# Altium project DARKYDEN.PrjPcb (part 4 of 9)
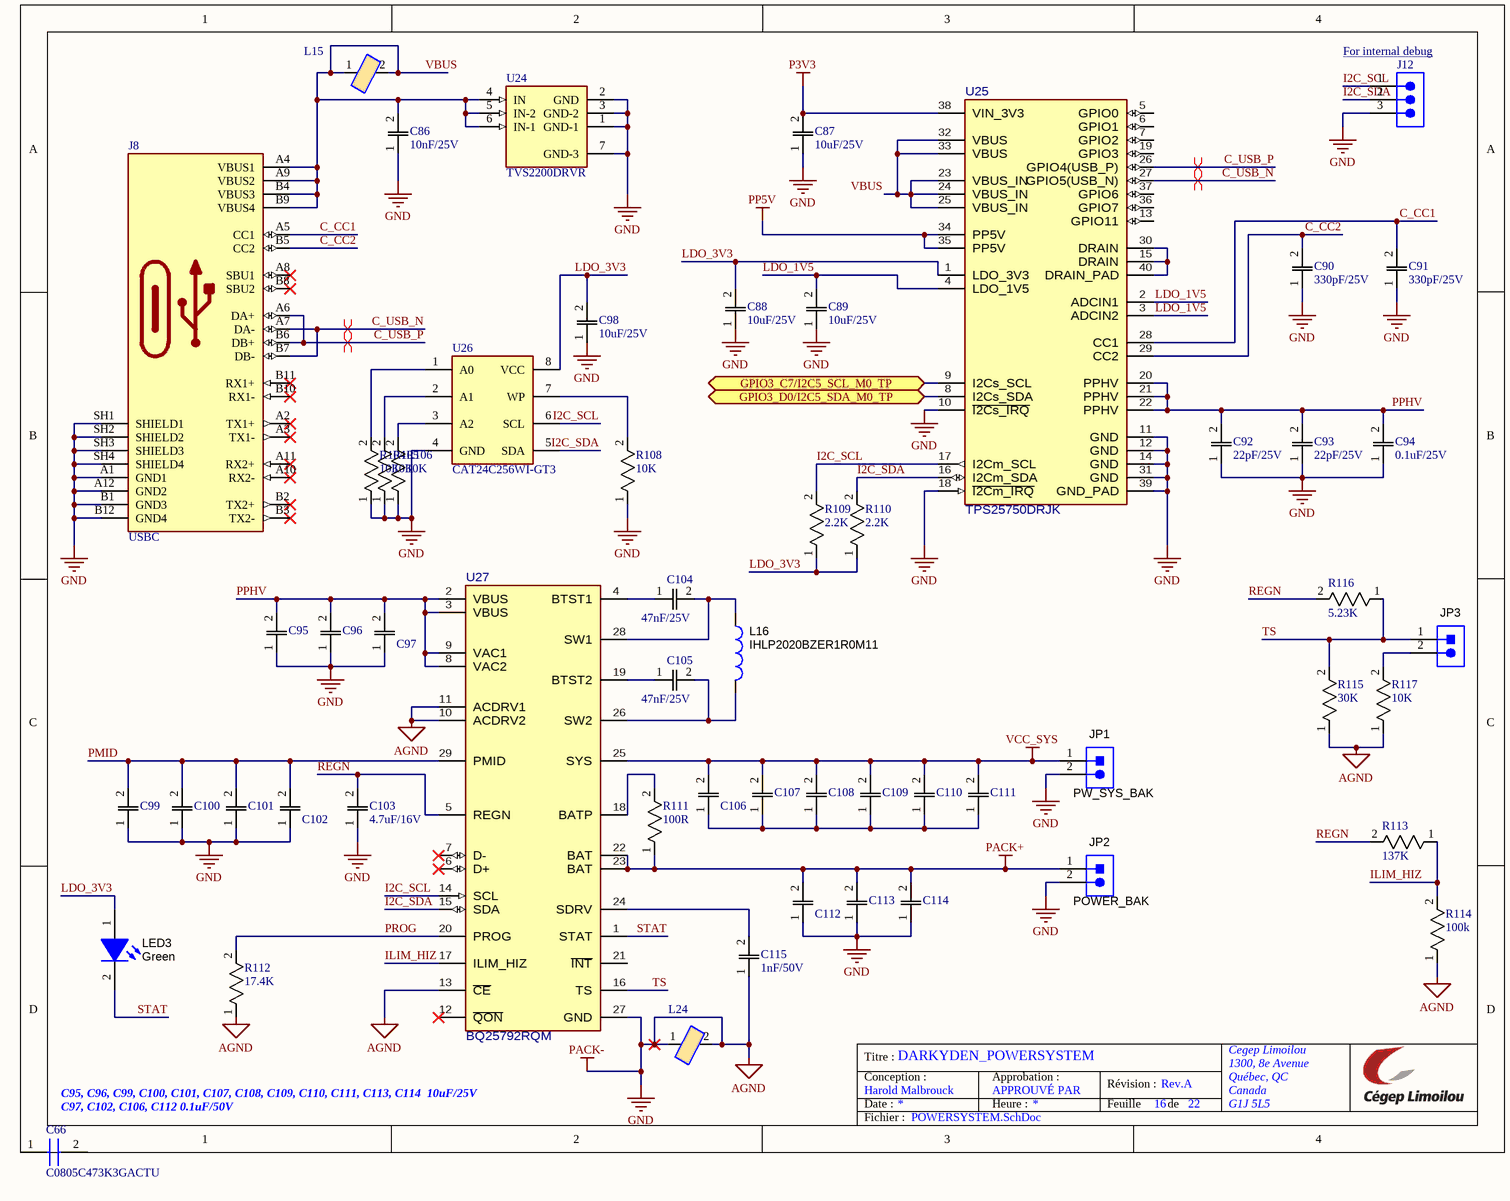
[diagram p10: POWERSYSTEM.SchDoc]

## Sheet POWERSYSTEM.SchDoc: DARKYDEN_POWERSYSTEM (continued)
### Library data of the parts
C66 = C0805C473K3GACTU: Capacitor; Manufacturer_Name: KEMET; Datasheet Link: https://content.kemet.com/datasheets/KEM_C1003_C0G_SMD.pdf; Height: 1.1mm; Manufacturer_Part_Number: C0805C473K3GACTU; Mouser Part Number: 80-C0805C473K3G; Mouser Price/Stock: https://www.mouser.co.uk/ProductDetail/KEMET/C0805C473K3GACTU?qs=hgatC5DSIDyRnutBseD8Ww%3D%3D; Arrow Part Number: C0805C473K3GACTU; Arrow Price/Stock: https://www.arrow.com/en/products/c0805c473k3gactu/kemet-corporation
C86 = C0805C103K3RACTU: 0.01uF 25V X7R 10% SMD 0805 125C Paper T/R; Manufacturer_Name: KEMET; Dielectric Material: Ceramic; Material: 4241ConductorMaterial; Value: 10nF; Dissipation Factor: 3.5%; Temperature Coefficient: 30ppm/°C; Datasheet Link: https://content.kemet.com/datasheets/KEM_C1002_X7R_SMD.pdf; Height: 1.1mm; Manufacturer_Part_Number: C0805C103K3RACTU; Mouser Part Number: 80-C0805C103K3R; Mouser Price/Stock: https://www.mouser.co.uk/ProductDetail/KEMET/C0805C103K3RACTU?qs=5x48ZXzl2vJVSrNkrDG8kg%3D%3D; Arrow Part Number: C0805C103K3RACTU; Arrow Price/Stock: https://www.arrow.com/en/products/c0805c103k3ractu/kemet-corporation; Supplier: Digikey; Supplier Part Number: 399-C0805C103K3RACTUCT-ND; Manufacturer: KEMET; Manufacturer Part Number: C0805C103K3RACTU; RoHS: Yes; Category: Ceramic Capacitors; Stock: 5327; Pricing: 1=0.12, 10=0.066, 100=0.0398, 1000=0.03092 (USD); Mounting Technology: Surface Mount; Case/Package: 0805; Case Code (Metric): 2012; Case Code (Imperial): 0805; Min Operating Temperature: -55°C; Max Operating Temperature: 125°C; Package Quantity: 4000; Voltage Rating: 25V; Tolerance: 10%; Packaging: Tape and Reel; Voltage Rating (DC): 25V; Dielectric: X7R; Termination: SMD/SMT; Series: SMD Comm X7R; Construction: Flat; Length: 2mm; Width: 1.2mm; Thickness: 0.035inch; Lead Pitch: 0.75mm; Depth: 1.25mm; Radiation Hardening: No; Reach SVHC Compliant: No; RoHS Compliant: Yes; ComponentLink1URL: http://www.farnell.com/datasheets/2746089.pdf?src-supplier=Farnell; ComponentLink1Description: http://www.farnell.com/datasheets/2746089.pdf?src-supplier=Farnell; ComponentLink2URL: http://www.farnell.com/datasheets/2315422.pdf?src-supplier=Farnell; ComponentLink2Description: http://www.farnell.com/datasheets/2315422.pdf?src-supplier=Farnell; ComponentLink3URL: http://components.arrow.com/part/dataview/2091057S98063N7429?src-supplier=Arrow+Electronics; ComponentLink3Description: http://components.arrow.com/part/dataview/2091057S98063N7429?src-supplier=Arrow+Electronics; ComponentLink4URL: http://www.mouser.com/ds/2/212/KEM_C1002_X7R_SMD-1102033.pdf?src-supplier=Mouser; ComponentLink4Description: http://www.mouser.com/ds/2/212/KEM_C1002_X7R_SMD-1102033.pdf?src-supplier=Mouser; ComponentLink5URL: https://www.verical.com/server-webapp/html/getDatasheet?partID=697850&src-supplier=Verical; ComponentLink5Description: https://www.verical.com/server-webapp/html/getDatasheet?partID=697850&src-supplier=Verical; ComponentLink6URL: http://www.jameco.com/Jameco/Products/ProdDS/1637716.pdf?src-supplier=Jameco; ComponentLink6Description: http://www.jameco.com/Jameco/Products/ProdDS/1637716.pdf?src-supplier=Jameco; ComponentLink7URL: https://api.kemet.com/component-edge/download/datasheet/C0805C103K3RACTU.pdf?src-supplier=Digikey; ComponentLink7Description: https://api.kemet.com/component-edge/download/datasheet/C0805C103K3RACTU.pdf?src-supplier=Digikey; ComponentLink8URL: http://capacitoredge.kemet.com/capedge2/DataSheet?pn=C0805C103K3RACTU&src-supplier=Avnet; ComponentLink8Description: http://capacitoredge.kemet.com/capedge2/DataSheet?pn=C0805C103K3RACTU&src-supplier=Avnet; ComponentLink9URL: http://www.farnell.com/datasheets/2746089.pdf?src-supplier=Newark; ComponentLink9Description: http://www.farnell.com/datasheets/2746089.pdf?src-supplier=Newark; ComponentLink10URL: https://datasheet.octopart.com/C0805C103K3RACTU-KEMET-datasheet-37550250.pdf?src-supplier=Electro+Sonic; ComponentLink10Description: https://datasheet.octopart.com/C0805C103K3RACTU-KEMET-datasheet-37550250.pdf?src-supplier=Electro+Sonic; ComponentLink11URL: https://datasheet.octopart.com/C0805C103K3RACTU-KEMET-datasheet-130259678.pdf?src-supplier=TME; ComponentLink11Description: https://datasheet.octopart.com/C0805C103K3RACTU-KEMET-datasheet-130259678.pdf?src-supplier=TME
C87-C89 C95 C96 C98-C101 C107-C111 C113 C114 = C0805C106K3PACTU: 10uF / 25 VDC, +85degC, X5R Dielec, +/-10% | KEMET C0805C106K3PACTU 0805; Dielectric Material: Ceramic; Material: 4241ConductorMaterial; Voltage Rating: 25V; Dissipation Factor: 10%; Mfr_Name: Kemet; Supplier: Digikey; Supplier Part Number: 399-11939-1-ND; Manufacturer: KEMET; Manufacturer Part Number: C0805C106K3PACTU; RoHS: Yes; Category: Ceramic Capacitors; Case/Package: 0805; Case Code (Metric): 2012; Case Code (Imperial): 0805; Min Operating Temperature: -55°C; Max Operating Temperature: 85°C; Dielectric: X5R; Packaging: Cut Tape; Voltage: 25V; Termination: Solder; Tolerance: 10%; Value: 10uF; Series: SMD Comm X5R; Voltage Rating (DC): 25V; Length: 2mm; Height: 1.25mm; Depth: 1.25mm; Reach SVHC Compliant: No; RoHS Compliant: Yes; Lead Free: 5697LeadFree; ComponentLink1URL: http://www.farnell.com/datasheets/2741185.pdf?src-supplier=Farnell; ComponentLink1Description: http://www.farnell.com/datasheets/2741185.pdf?src-supplier=Farnell; ComponentLink2URL: http://www.alliedelec.com/m/d/f3c02ddb98afa3dd1adcb801109671e9.pdf?src-supplier=Allied+Electronics; ComponentLink2Description: http://www.alliedelec.com/m/d/f3c02ddb98afa3dd1adcb801109671e9.pdf?src-supplier=Allied+Electronics; ComponentLink3URL: https://api.kemet.com/component-edge/download/datasheet/C0805C106K3PAC7800.pdf?src-supplier=Digikey; ComponentLink3Description: https://api.kemet.com/component-edge/download/datasheet/C0805C106K3PAC7800.pdf?src-supplier=Digikey; ComponentLink4URL: http://www.kemet.com/Lists/ProductCatalog/Attachments/19/KEM_C1006_X5R_SMD.pdf?src-supplier=Avnet; ComponentLink4Description: http://www.kemet.com/Lists/ProductCatalog/Attachments/19/KEM_C1006_X5R_SMD.pdf?src-supplier=Avnet; ComponentLink5URL: http://www.farnell.com/datasheets/2741185.pdf?src-supplier=Element14; ComponentLink5Description: http://www.farnell.com/datasheets/2741185.pdf?src-supplier=Element14; ComponentLink6URL: http://www.farnell.com/datasheets/2741185.pdf?src-supplier=Newark; ComponentLink6Description: http://www.farnell.com/datasheets/2741185.pdf?src-supplier=Newark; ComponentLink7URL: https://datasheet.octopart.com/C0805C106K3PACTU-Kemet-datasheet-46909776.pdf?src-supplier=Element14; ComponentLink7Description: https://datasheet.octopart.com/C0805C106K3PACTU-Kemet-datasheet-46909776.pdf?src-supplier=Element14
C90 C91 = C0805C331K3GACTU: 330pF 25VC0G 0805 10%; Manufacturer_Name: KEMET; Dielectric Material: Ceramic; Material: 4241ConductorMaterial; Voltage Rating (DC): 25V; Dielectric: C0G; Temperature Coefficient: 30ppm/°C; Datasheet Link: https://content.kemet.com/datasheets/KEM_C1003_C0G_SMD.pdf; Height: 1.1mm; Manufacturer_Part_Number: C0805C331K3GACTU; Mouser Part Number: 80-C0805C331K3G; Mouser Price/Stock: https://www.mouser.com/Search/Refine.aspx?Keyword=80-C0805C331K3G; Supplier: Digikey; Supplier Part Number: 399-C0805C331K3GACTUCT-ND; Manufacturer: KEMET; Manufacturer Part Number: C0805C331K3GACTU; RoHS: Yes; Category: Ceramic Capacitors; Stock: 3769; Pricing: 1=0.26, 10=0.151, 100=0.0965, 1000=0.06823 (USD); Mounting Technology: Surface Mount; Case/Package: 0805; Case Code (Imperial): 0805; Case Code (Metric): 2012; Weight: 0.000194oz; Min Operating Temperature: -55°C; Max Operating Temperature: 125°C; Value: 330pF; Tolerance: 10%; Construction: Flat; Voltage Rating: 25V; Packaging: Tape and Reel; Termination: SMD/SMT; Series: SMD Comm C0G; Length: 2mm; Width: 1.25mm; Depth: 1.25mm; Lead Free: Lead Free; RoHS Compliant: Yes; ComponentLink1URL: http://www.mouser.com/ds/2/212/KEM_C1003_C0G_SMD-1101588.pdf?src-supplier=Mouser; ComponentLink1Description: http://www.mouser.com/ds/2/212/KEM_C1003_C0G_SMD-1101588.pdf?src-supplier=Mouser; ComponentLink2URL: http://components.arrow.com/part/dataview/29547903S8614793N7429?src-supplier=Arrow+Electronics; ComponentLink2Description: http://components.arrow.com/part/dataview/29547903S8614793N7429?src-supplier=Arrow+Electronics; ComponentLink3URL: https://api.kemet.com/component-edge/download/datasheet/C0805C331K3GACTU.pdf?src-supplier=Digikey; ComponentLink3Description: https://api.kemet.com/component-edge/download/datasheet/C0805C331K3GACTU.pdf?src-supplier=Digikey
C92 C93 = CL21A226MAYNNNE: 22uF/25V 20% X5R 0805; Manufacturer_Name: SAMSUNG; Value: 22uF; Voltage Rating: 25V; Datasheet Link: http://product.samsungsem.com/mlcc/CL21A226MAYNNN.do; Height: 1.45mm; Manufacturer_Part_Number: CL21A226MAYNNNE; Mouser Part Number: 187-CL21A226MAYNNNE; Mouser Price/Stock: https://www.mouser.co.uk/ProductDetail/Samsung-Electro-Mechanics/CL21A226MAYNNNE?qs=xZ%2FP%252Ba9zWqY%2FVvCfXjMhqg%3D%3D; Arrow Part Number: CL21A226MAYNNNE; Arrow Price/Stock: https://www.arrow.com/en/products/cl21a226maynnne/samsung-electro-mechanics?utm_currency=USD&region=nac; Supplier: Digikey; Supplier Part Number: 1276-CL21A226MAYNNNECT-ND; Manufacturer: Samsung; Manufacturer Part Number: CL21A226MAYNNNE; RoHS: Yes; Category: Ceramic Capacitors; Stock: 687201; Pricing: 1=0.14, 10=0.083, 100=0.0544, 1000=0.04301 (USD); Case/Package: 0805; Min Operating Temperature: -55°C; Max Operating Temperature: 85°C; Dielectric: X5R; Tolerance: 20%; Voltage Rating (DC): 25V; RoHS Compliant: Yes; ComponentLink1URL: https://datasheet.octopart.com/CL21A226MAYNNNE-Samsung-Electro-Mechanics-datasheet-149154243.pdf?src-supplier=Future+Electronics; ComponentLink1Description: https://datasheet.octopart.com/CL21A226MAYNNNE-Samsung-Electro-Mechanics-datasheet-149154243.pdf?src-supplier=Future+Electronics
C94 = C0805C104K3RACTU: 0.1uF 25V X7R 10% SMD 0805 125C Plastic T/R; Mfr_Name: Kemet; Material: 4241ConductorMaterial; Value: 100nF; Temperature Coefficient: 30ppm/°C; Supplier: Digikey; Supplier Part Number: 399-C0805C104K3RACTUCT-ND; Manufacturer: KEMET; Manufacturer Part Number: C0805C104K3RACTU; RoHS: Yes; Category: Ceramic Capacitors; Mounting Technology: Surface Mount,PCB; Case/Package: 0805; Pins: 2NUMBER; Case Code (Imperial): 0805; Case Code (Metric): 2012; Min Operating Temperature: -55°C; Max Operating Temperature: 125°C; Packaging: Tape and Reel; Tolerance: 10%; Dielectric: X7R; Termination: SMD/SMT; Package Quantity: 4000; Voltage Rating: 25V; Series: SMD Comm X7R; Voltage Rating (DC): 25V; Construction: Flat; Length: 2mm; Width: 1.2mm; Height: 0.9mm; Depth: 1.25mm; Lead Pitch: 0.75mm; Thickness: 889um; Radiation Hardening: No; RoHS Compliant: Yes; Lead Free: 5697LeadFree; Reach SVHC Compliant: 4186SVHC; ComponentLink1URL: https://datasheet.ciiva.com/7842/kem-c1002-x7r-smd-7842536.pdf?src-supplier=Element14; ComponentLink1Description: https://datasheet.ciiva.com/7842/kem-c1002-x7r-smd-7842536.pdf?src-supplier=Element14; ComponentLink2URL: https://datasheet.ciiva.com/7842/kem-c1002-x7r-smd-7842538.pdf?src-supplier=Element14; ComponentLink2Description: https://datasheet.ciiva.com/7842/kem-c1002-x7r-smd-7842538.pdf?src-supplier=Element14
C97 C102 C106 C112 = C0805C104K5RACTU: 0.1uF/50V X7R 10% 0805 Multilayer Ceramic Capacitors Mlcc Smd/Smt Rohs; Manufacturer_Name: KEMET; Material: 4241ConductorMaterial; Value: 100nF; Voltage Rating: 50V; Voltage: 500V; Temperature Coefficient: 30ppm/°C; Datasheet Link: https://content.kemet.com/datasheets/KEM_C1002_X7R_SMD.pdf; Height: 1.1mm; Manufacturer_Part_Number: C0805C104K5RACTU; Mouser Part Number: 80-C0805C104K5R; Mouser Price/Stock: https://www.mouser.co.uk/ProductDetail/KEMET/C0805C104K5RACTU?qs=Pc30aiB8zWUISNb2Qeyxfw%3D%3D; Arrow Part Number: C0805C104K5RACTU; Arrow Price/Stock: https://www.arrow.com/en/products/c0805c104k5ractu/kemet-corporation?utm_currency=USD&region=nac; Supplier: Digikey; Supplier Part Number: 399-C0805C104K5RACTUCT-ND; Manufacturer: KEMET; Manufacturer Part Number: C0805C104K5RACTU; RoHS: Yes; Category: Ceramic Capacitors; Stock: 625118; Pricing: 1=0.09, 10=0.037, 100=0.0248, 1000=0.0224 (USD); Mounting Technology: Surface Mount,PCB; Case/Package: 0805; Pins: 2; Case Code (Imperial): 0805; Case Code (Metric): 2012; Min Operating Temperature: -55°C; Max Operating Temperature: 125°C; Package Quantity: 4000; Tolerance: 10%; Packaging: Tape and Reel; Voltage Rating (DC): 50V; Dielectric: X7R; Termination: SMD/SMT; Series: SMD Comm X7R; Construction: Flat; Length: 2mm; Width: 1.2mm; Lead Pitch: 0.75mm; Depth: 1.25mm; Radiation Hardening: No; Reach SVHC Compliant: No; RoHS Compliant: Yes; Lead Free: 5697LeadFree; ComponentLink1URL: https://datasheet.ciiva.com/32431/slceramic-chip-condensers-e-32431755.pdf?src-supplier=Distrelec; ComponentLink1Description: https://datasheet.ciiva.com/32431/slceramic-chip-condensers-e-32431755.pdf?src-supplier=Distrelec; ComponentLink2URL: https://datasheet.ciiva.com/28682/1851736-28682232.pdf?src-supplier=Element14; ComponentLink2Description: https://datasheet.ciiva.com/28682/1851736-28682232.pdf?src-supplier=Element14; ComponentLink3URL: https://datasheet.ciiva.com/18410/70095383-18410815.pdf?src-supplier=Allied+Electronics; ComponentLink3Description: https://datasheet.ciiva.com/18410/70095383-18410815.pdf?src-supplier=Allied+Electronics; ComponentLink4URL: https://datasheet.ciiva.com/14589/70095383-14589048.pdf?src-supplier=Allied+Electronics; ComponentLink4Description: https://datasheet.ciiva.com/14589/70095383-14589048.pdf?src-supplier=Allied+Electronics
C103 = C0805C475K4RACTU: 4.7 uF, 16 V, ± 10%, X7R, 0805 [2012 Metric]; Manufacturer_Name: KEMET; Dielectric Material: Ceramic; Material: 4241ConductorMaterial; Value: 4.7uF; Voltage Rating: 16V; Dissipation Factor: 5%; Datasheet Link: https://content.kemet.com/datasheets/KEM_C1002_X7R_SMD.pdf; Height: 1.1mm; Manufacturer_Part_Number: C0805C475K4RACTU; Mouser Part Number: 80-C0805C475K4R; Mouser Price/Stock: https://www.mouser.co.uk/ProductDetail/KEMET/C0805C475K4RACTU?qs=iP0bYSAMAFomlmlmK2IJkg%3D%3D; Arrow Part Number: C0805C475K4RACTU; Arrow Price/Stock: https://www.arrow.com/en/products/c0805c475k4ractu/kemet-corporation?region=nac; Supplier: Digikey; Supplier Part Number: 399-C0805C475K4RACTUCT-ND; Manufacturer: KEMET; Manufacturer Part Number: C0805C475K4RACTU; RoHS: Yes; Category: Ceramic Capacitors; Stock: 21230; Pricing: 1=0.23, 10=0.131, 100=0.1203, 1000=0.10305 (USD); Mounting Technology: Surface Mount; Case/Package: 0805; Case Code (Metric): 2012; Case Code (Imperial): 0805; Min Operating Temperature: -55°C; Max Operating Temperature: 125°C; Packaging: Tape and Reel; Tolerance: 10%; Package Quantity: 1; Voltage Rating (DC): 16V; Dielectric: X7R; Termination: SMD/SMT; Voltage: 16V; Series: C; Length: 2mm; Width: 0.049inch; Thickness: 0.055inch; Depth: 1.25mm; Reach SVHC Compliant: No; RoHS Compliant: Yes; ComponentLink1URL: https://datasheet.ciiva.com/28682/1851736-28682348.pdf?src-supplier=Element14; ComponentLink1Description: https://datasheet.ciiva.com/28682/1851736-28682348.pdf?src-supplier=Element14; ComponentLink2URL: https://datasheet.ciiva.com/5408/kem-c1002-x7r-smd-5408584.pdf?src-supplier=Mouser; ComponentLink2Description: https://datasheet.ciiva.com/5408/kem-c1002-x7r-smd-5408584.pdf?src-supplier=Mouser
C104 C105 = C0805C473K3GACTU: 47nF/25V C0G 10% Pad SMD 0805 125C Extreme Low ESR T/R; Manufacturer_Name: KEMET; Dielectric Material: Ceramic; Material: 4241ConductorMaterial; Value: 47nF; Voltage Rating (DC): 25V; Dissipation Factor: 0.1%; Temperature Coefficient: 30ppm/°C; Datasheet Link: https://content.kemet.com/datasheets/KEM_C1003_C0G_SMD.pdf; Height: 1.1mm; Manufacturer_Part_Number: C0805C473K3GACTU; Mouser Part Number: 80-C0805C473K3G; Mouser Price/Stock: https://www.mouser.co.uk/ProductDetail/KEMET/C0805C473K3GACTU?qs=hgatC5DSIDyRnutBseD8Ww%3D%3D; Arrow Part Number: C0805C473K3GACTU; Arrow Price/Stock: https://www.arrow.com/en/products/c0805c473k3gactu/kemet-corporation; Supplier: Digikey; Supplier Part Number: 399-C0805C473K3GACTUCT-ND; Manufacturer: KEMET; Manufacturer Part Number: C0805C473K3GACTU; RoHS: Yes; Category: Ceramic Capacitors; Stock: 53635; Pricing: 1=0.73, 10=0.458, 100=0.3172, 1000=0.24413 (USD); Mounting Technology: Surface Mount; Case/Package: 0805; Case Code (Imperial): 0805; Case Code (Metric): 2012; Min Operating Temperature: -55°C; Max Operating Temperature: 125°C; Tolerance: 10%; Dielectric: C0G; Package Quantity: 2500; Voltage Rating: 25V; Packaging: Tape and Reel; Termination: SMD/SMT; Series: C0805C; Length: 0.079inch; Width: 1.2mm; Thickness: 0.055inch; Lead Free: Lead Free; RoHS Compliant: Yes; ComponentLink1URL: http://www.mouser.com/ds/2/212/KEM_C1003_C0G_SMD-1101588.pdf?src-supplier=Mouser; ComponentLink1Description: http://www.mouser.com/ds/2/212/KEM_C1003_C0G_SMD-1101588.pdf?src-supplier=Mouser; ComponentLink2URL: https://datasheet.octopart.com/C0805C473K3GACTU-KEMET-datasheet-149524387.pdf?src-supplier=Farnell; ComponentLink2Description: https://datasheet.octopart.com/C0805C473K3GACTU-KEMET-datasheet-149524387.pdf?src-supplier=Farnell; ComponentLink3URL: http://www.kemet.com/docfinder?Partnumber=C0805C473K3GACTU&src-supplier=Digikey; ComponentLink3Description: http://www.kemet.com/docfinder?Partnumber=C0805C473K3GACTU&src-supplier=Digikey; ComponentLink4URL: https://datasheet.octopart.com/C0805C473K3GACTU-KEMET-datasheet-170333844.pdf?src-supplier=Element14; ComponentLink4Description: https://datasheet.octopart.com/C0805C473K3GACTU-KEMET-datasheet-170333844.pdf?src-supplier=Element14; ComponentLink5URL: https://datasheet.octopart.com/C0805C473K3GACTU-KEMET-datasheet-170576076.pdf?src-supplier=Newark; ComponentLink5Description: https://datasheet.octopart.com/C0805C473K3GACTU-KEMET-datasheet-170576076.pdf?src-supplier=Newark
C115 = C0805C102K5RACTU: Multilayer Ceramic Capacitor 1000 Pf 50 V ½ 10% X7R 0805 [2012 Metric]; Manufacturer_Name: KEMET; Manufacturer_Part_Number: C0805C102K5RAC-TU; Dielectric Material: 4241ConductorMaterial; Value: 1nF; Voltage Rating (DC): 50V; Temperature Coefficient: 30ppm/°C; Datasheet Link: https://componentsearchengine.com/Datasheets/2/C0805C102K5RAC-TU.pdf; Height: 0.88mm; Supplier: Digikey; Supplier Part Number: 399-C0805C102K5RACTUCT-ND; Manufacturer: KEMET; Manufacturer Part Number: C0805C102K5RACTU; RoHS: Yes; Category: Ceramic Capacitors; Stock: 137971; Pricing: 1=0.11, 10=0.06, 100=0.0358, 1000=0.0235 (USD); Mounting Technology: Surface Mount,PCB; Case/Package: 0805; Pins: 2; Case Code (Imperial): 0805; Case Code (Metric): 2012; Material: 4241ConductorMaterial; Min Operating Temperature: -55°C; Max Operating Temperature: 125°C; Tolerance: 10%; Packaging: Tape and Reel; Dielectric: X7R; Voltage: 50V; Series: SMD Comm X7R; Voltage Rating: 50V; Package Quantity: 4000; Termination: SMD/SMT; Construction: Flat; Length: 2mm; Width: 1.25mm; Lead Pitch: 0.75mm; Depth: 1.25mm; Thickness: 889um; Radiation Hardening: No; Reach SVHC Compliant: No; RoHS Compliant: Yes; Lead Free: 5697LeadFree; ComponentLink1URL: https://datasheet.ciiva.com/18193/getdatasheetpartid-385640-18193338.pdf?src-supplier=Verical; ComponentLink1Description: https://datasheet.ciiva.com/18193/getdatasheetpartid-385640-18193338.pdf?src-supplier=Verical; ComponentLink2URL: https://datasheet.ciiva.com/39122/docfinderpartnumberc0402c102k5ractu-39122922.pdf?src-supplier=Onlinecomponents.com; ComponentLink2Description: https://datasheet.ciiva.com/39122/docfinderpartnumberc0402c102k5ractu-39122922.pdf?src-supplier=Onlinecomponents.com; ComponentLink3URL: https://datasheet.ciiva.com/7842/1918693-7842527.pdf?src-supplier=Element14; ComponentLink3Description: https://datasheet.ciiva.com/7842/1918693-7842527.pdf?src-supplier=Element14
J8 = USBC: USB-C (USB TYPE-C) USB 3.2 Gen 2 (USB 3.1 Gen 2, Superspeed + (USB 3.1)) Receptacle Connector 24 Position Surface Mount, Right Angle; Through Hole; MF: Molex; MP: 2012670005; SnapEDA_Link: https://www.snapeda.com/parts/2012670005/Molex/view-part/?ref=snap; Package: None; Value: *; Check_prices: https://www.snapeda.com/parts/2012670005/Molex/view-part/?ref=eda
J12 = 61300311121: WR-PHD Pin Header, THT, Vertical, pitch 2.54mm, 1 Row, 3P; Manufacturer: Wurth Elektronik; Contact Resistance: 20mOhm; Rated Current: 3A; Working Voltage: 250V; Withstanding Voltage: 500V; Manufacturer Part Number: 61300311121; Category: Board-to-Board Connectors; Match Code: WR-PHD; ComponentLink1Description: Website Link; ComponentLink1URL: https://www.we-online.com/redexpert/article/61300311121?ad; ComponentLink2Description: Datasheet Link; ComponentLink2URL: https://www.we-online.com/redexpert/spec/61300311121?ad; Mount: Through Hole; Operating Temperature Max: 105°C; Operating Temperature Min: -40°C; Packaging: Bag; Gender: Pin Header; Number of Pins: 3; Number of Rows: 1; Orientation: Vertical; Pitch: 2.54mm
JP1-JP3 = Header_2x1: Header, 100mil, 2x1, Tin, TH; PartNumber: PEC02SAAN; Manufacturer: Sullins Connector Solutions; Pitch_mm: 2.54; Gender: Male; Shrouded: N; Row_Count: 1; Current_A: 3A; Voltage_V: 1.8kV; Cert_UL: Y; CNHeader: TRUE; CT: FALSE; Green_Lifecycle: Not Set; Green_REACh: Incomplete; PackageReference: Header, 2 PIN, 100mil, Tin; CompType: Header; RoHS: Y; MountType: TH; ComponentLink1Description: Datasheet URL; ComponentLink1URL: http://www.sullinscorp.com/catalogs/77_PAGE108-109_.100_MALE_HDR.pdf; Publisher: Texas Instruments; LatestRevisionDate: 26/05/2017; Supplier 1: Digi-Key; Supplier Part Number 1: S1012E-02-ND; ClassName: Header; Orientation: Vertical; PinCount: 2; ContactFinish: Tin; Color: Black; Green_EU RoHS-2: Incomplete; Green_EU RoHS: Incomplete
L15 L24 = FBMJ2125HM210NT: Ferrite Beads Power Chip 21Ohm 30% 100MHz 6A 0.004Ohm DCR 0805 Automotive T/R; Manufacturer: Taiyo Yuden; Impedance: 21R; Number of Lines: 1; Shielding: Unshielded; ComponentLink1URL: https://datasheet.ciiva.com/6212/fbmj2125hm210nt-ss-6212912.pdf?src-supplier=Digikey; RoHS: Yes; ComponentLink1Description: https://datasheet.ciiva.com/6212/fbmj2125hm210nt-ss-6212912.pdf?src-supplier=Digikey; Datasheet Link: https://datasheet.datasheetarchive.com/originals/distributors/Datasheets-DGA6/557945.pdf; Height: 1.05mm; Manufacturer_Name: TAIYO YUDEN; Manufacturer_Part_Number: FBMJ2125HM210NT; Mouser Part Number: 963-FBMJ2125HM210NT; Mouser Price/Stock: https://www.mouser.co.uk/ProductDetail/TAIYO-YUDEN/FBMJ2125HM210NT?qs=I6KAKw0tg2zeLlwEEK9qzQ%3D%3D; Arrow Part Number: FBMJ2125HM210NT; Arrow Price/Stock: https://www.arrow.com/en/products/fbmj2125hm210nt/taiyo-yuden?region=nac; Supplier: Digikey; Supplier Part Number: 587-1765-1-ND; Manufacturer Part Number: FBMJ2125HM210NT; Category: Ferrite Beads and Chips; Stock: 27778; Pricing: 1=0.11, 10=0.081, 25=0.07, 50=0.063, 100=0.0563, 250=0.04844, 500=0.04302, 1000=0.03801 (USD); Mounting Technology: Surface Mount; Case/Package: 0805; Pins: 2; Core Material: Ferrite; Case Code (Metric): 2012; Case Code (Imperial): 0805; Material: Ferrite; Min Operating Temperature: -40°C; Max Operating Temperature: 125°C; Package Quantity: 4000; Packaging: Tape and Reel; Tolerance: 30%; Max Current Rating: 6A; Max DC Current: 6A; Termination: SMD/SMT; Test Frequency: 100MHz; Series: FB; Frequency: 100MHz; Length: 2mm; Width: 1.25mm; Depth: 1.45mm; RoHS Compliant: Yes; Lead Free: Lead Free; Halogen Free: Halogen Free; Reach SVHC Compliant: Unknown; ComponentLink2URL: https://datasheet.ciiva.com/25614/0900766b810b37be-25614411.pdf?src-supplier=Rs; ComponentLink2Description: https://datasheet.ciiva.com/25614/0900766b810b37be-25614411.pdf?src-supplier=Rs; ComponentLink3URL: https://datasheet.ciiva.com/6212/chipbeads01-e-6212908.pdf?src-supplier=Digikey; ComponentLink3Description: https://datasheet.ciiva.com/6212/chipbeads01-e-6212908.pdf?src-supplier=Digikey; ComponentLink4URL: https://datasheet.ciiva.com/6212/chipbeads01-e-6212907.pdf?src-supplier=Digikey; ComponentLink4Description: https://datasheet.ciiva.com/6212/chipbeads01-e-6212907.pdf?src-supplier=Digikey
L16 = IHLP2020BZER1R0M11: Inductor, Shielded Drum Core, Powdered Iron, 1 uH, 7 A, 0.0181 ohm, SMD; Manufacturer: Vishay-Dale; Isat: 7A @ 20% inductance drop; Irms: 7.5A @ 40C rise; Green_Lifecycle: Active; SizeAreaWB_mm2: 53.7782; DCR_ohm: 0.0181; Green_REACh: Passed; Value: 1uH; Imax_A: 7A; SizeZ_mm: 2; SizeX_mm: 5.49; SizeY_mm: 5.18; SizeArea_mm2: 28.4382; Ind_H: 1µH; AEC Category: Q200; ComponentLink1URL: http://www.vishay.com/docs/34261/lp20bz11.pdf; Publisher: Texas Instruments; Published: 2008-06-26; RoHS: Y; Value1: 0.0181 ohm; Material: Powdered Iron; MountType: SMT; Green_EU RoHS-2: Passed; Supplier 1: Digi-Key; Green_EU RoHS: Passed; PackageReference: 5.49x2x5.18mm; Value2: 7A; CompType: Inductor; LatestRevisionDate: 2017-06-02; PartNumber: IHLP2020BZER1R0M11; AEC Qualified: ?; ComponentLink1Description: Datasheet link; Supplier Part Number 1: 541-1218-1-ND; Technology: Shielded Drum Core
LED3 = LED_Gr_SMD: LED, Green, SMD; Manufacturer: Lite-On; Vf_V: 2.1V; Io_A: 20mA; Power_TotalModule: 100mW; Value1: 0.1W; CompType: LED; PartNumber: LTST-C190GKT; MountType: SMT; RoHS: Y; PackageReference: 1.6x0.8x0.8mm; Type: ?; Value2: 2.1V; Color: green; ComponentLink1URL: https://sps06.itg.ti.com/sites/KMS/crossdivteams/altium/docs/ComponentDatasheets/LTST-C190GKT.pdf; ComponentLink1Description: Datasheet link
R104-R106 R108 R117 = ERJ-3GEYJ103V: 10K Ohm 5% Res Thick Film 0603  0.1W(1/10W) ±200ppm/C Pad SMD Automotive T/R; Manufacturer_Name: Panasonic; Value: 10kR; Temperature Coefficient: 200ppm/°C; Power Rating: 100mW; Voltage Rating: 75V; Datasheet Link: http://docs-europe.electrocomponents.com/webdocs/13ba/0900766b813ba21b.pdf; Height: 0.55mm; Manufacturer_Part_Number: ERJ-3GEYJ103V; Mouser Part Number: 667-ERJ-3GEYJ103V; Mouser Price/Stock: https://www.mouser.co.uk/ProductDetail/Panasonic/ERJ-3GEYJ103V?qs=66DK8nO8gJBWgc%252B0VNNxzg%3D%3D; Arrow Part Number: ERJ-3GEYJ103V; Arrow Price/Stock: https://www.arrow.com/en/products/erj-3geyj103v/panasonic?region=europe; Supplier: Digikey; Supplier Part Number: P10KGCT-ND; Manufacturer: Panasonic; Manufacturer Part Number: ERJ-3GEYJ103V; RoHS: Yes; Category: Chip SMD Resistors; Stock: 2191587; Pricing: 1=0.1, 10=0.033, 50=0.02, 100=0.0165, 500=0.01096, 1000=0.00939 (USD); Mounting Technology: Surface Mount; Case/Package: 0603; Case Code (Imperial): 0603; Case Code (Metric): 1608; Weight: 7.1E-05oz; Contact Plating: Tin; Min Operating Temperature: -55°C; Max Operating Temperature: 155°C; Tolerance: 5%; Packaging: Tape and Reel; Technology: THICK FILM; Package Quantity: 1; Resistor Type: Thick Film; Termination: SMD/SMT; Number of Terminations: 2; Max Power Dissipation: 100mW; Working Voltage: 75V; Features: Automotive AEC-Q200; Series: ERJ; Construction: Rectangular; Resistance Tolerance: 5%; Length: 1.6mm; Width: 0.8mm; Depth: 0.8mm; Reach SVHC Compliant: No; Military Standard: Not; Lead Free: Lead Free; RoHS Compliant: Yes; ComponentLink1URL: https://datasheet.ciiva.com/11809/0900766b80f806dd-11809566.pdf?src-supplier=Rs; ComponentLink1Description: https://datasheet.ciiva.com/11809/0900766b80f806dd-11809566.pdf?src-supplier=Rs; ComponentLink2URL: https://datasheet.ciiva.com/34303/2007265-34303757.pdf?src-supplier=Jameco; ComponentLink2Description: https://datasheet.ciiva.com/34303/2007265-34303757.pdf?src-supplier=Jameco; ComponentLink3URL: https://datasheet.ciiva.com/48531/aoa0000ce1-48531887.pdf?src-supplier=Avnet; ComponentLink3Description: https://datasheet.ciiva.com/48531/aoa0000ce1-48531887.pdf?src-supplier=Avnet; ComponentLink4URL: https://datasheet.ciiva.com/9117/aoa0000ce1-9117038.pdf?src-supplier=Avnet; ComponentLink4Description: https://datasheet.ciiva.com/9117/aoa0000ce1-9117038.pdf?src-supplier=Avnet; ComponentLink5URL: https://datasheet.ciiva.com/28514/1678796-28514213.pdf?src-supplier=Element14; ComponentLink5Description: https://datasheet.ciiva.com/28514/1678796-28514213.pdf?src-supplier=Element14; ComponentLink6URL: https://datasheet.ciiva.com/46371/1678796-46371909.pdf?src-supplier=Element14; ComponentLink6Description: https://datasheet.ciiva.com/46371/1678796-46371909.pdf?src-supplier=Element14; ComponentLink7URL: https://datasheet.ciiva.com/46385/1678796-46385240.pdf?src-supplier=Element14; ComponentLink7Description: https://datasheet.ciiva.com/46385/1678796-46385240.pdf?src-supplier=Element14; ComponentLink8URL: https://datasheet.ciiva.com/24133/aoa0000ce1-37422-24133064.pdf?src-supplier=Mouser; ComponentLink8Description: https://datasheet.ciiva.com/24133/aoa0000ce1-37422-24133064.pdf?src-supplier=Mouser; ComponentLink9URL: https://datasheet.ciiva.com/16740/aoa0000ce1-16740655.pdf?src-supplier=Future+Electronics; ComponentLink9Description: https://datasheet.ciiva.com/16740/aoa0000ce1-16740655.pdf?src-supplier=Future+Electronics; ComponentLink10URL: https://datasheet.ciiva.com/30147/4aoa0000ce1-30147029.pdf?src-supplier=Onlinecomponents.com; ComponentLink10Description: https://datasheet.ciiva.com/30147/4aoa0000ce1-30147029.pdf?src-supplier=Onlinecomponents.com
R109 R110 = ERJ-3GEYJ222V: 2.2 kOhm, ï¿½ 5%, 100 mW, 0603 [1608 Metric], Thick Film, General Purpose; Manufacturer_Name: Panasonic; Value: 2.2kR; Power Rating: 100mW; Voltage Rating: 75V; Temperature Coefficient: 200ppm/°C; Voltage Rating (DC): 50V; Datasheet Link: http://docs-europe.electrocomponents.com/webdocs/13ba/0900766b813ba21b.pdf; Height: 0.55mm; Manufacturer_Part_Number: ERJ-3GEYJ222V; Mouser Part Number: 667-ERJ-3GEYJ222V; Mouser Price/Stock: https://www.mouser.co.uk/ProductDetail/Panasonic/ERJ-3GEYJ222V?qs=4WZYzuGhm5pzxkuuO4fqIg%3D%3D; Arrow Part Number: ERJ-3GEYJ222V; Arrow Price/Stock: https://www.arrow.com/en/products/erj-3geyj222v/panasonic?region=nac; Supplier: Digikey; Supplier Part Number: P2.2KGCT-ND; Manufacturer: Panasonic; Manufacturer Part Number: ERJ-3GEYJ222V; RoHS: Yes; Category: Chip SMD Resistors; Stock: 308618; Pricing: 1=0.1, 10=0.033, 50=0.02, 100=0.0165, 500=0.01096, 1000=0.00939 (USD); Mounting Technology: Surface Mount; Case/Package: 0603; Case Code (Imperial): 0603; Case Code (Metric): 1608; Contact Plating: Tin; Min Operating Temperature: -55°C; Max Operating Temperature: 155°C; Package Quantity: 1; Packaging: Tape and Reel; Tolerance: 5%; Resistor Type: Thick Film; Number of Terminations: 2; Termination: SMD/SMT; Max Power Dissipation: 100mW; Working Voltage: 75V; Features: Automotive AEC-Q200; Series: ERJ; Resistance Tolerance: 5%; Construction: Rectangular; Technology: THICK FILM; Length: 1.6mm; Width: 0.8mm; Depth: 0.8mm; Radiation Hardening: No; Reach SVHC Compliant: No; Military Standard: Not; Lead Free: Lead Free; RoHS Compliant: Yes; ComponentLink1URL: https://datasheet.ciiva.com/11821/0900766b80f806dd-11821453.pdf?src-supplier=Rs; ComponentLink1Description: https://datasheet.ciiva.com/11821/0900766b80f806dd-11821453.pdf?src-supplier=Rs; ComponentLink2URL: https://datasheet.ciiva.com/34303/1988639-34303614.pdf?src-supplier=Jameco; ComponentLink2Description: https://datasheet.ciiva.com/34303/1988639-34303614.pdf?src-supplier=Jameco; ComponentLink3URL: https://datasheet.ciiva.com/22758/1500035-22758223.pdf?src-supplier=Farnell; ComponentLink3Description: https://datasheet.ciiva.com/22758/1500035-22758223.pdf?src-supplier=Farnell; ComponentLink4URL: https://datasheet.ciiva.com/9117/aoa0000ce1-9117127.pdf?src-supplier=Avnet; ComponentLink4Description: https://datasheet.ciiva.com/9117/aoa0000ce1-9117127.pdf?src-supplier=Avnet; ComponentLink5URL: https://datasheet.ciiva.com/28584/1678796-28584095.pdf?src-supplier=Element14; ComponentLink5Description: https://datasheet.ciiva.com/28584/1678796-28584095.pdf?src-supplier=Element14; ComponentLink6URL: https://datasheet.ciiva.com/46380/1500035-46380411.pdf?src-supplier=Element14; ComponentLink6Description: https://datasheet.ciiva.com/46380/1500035-46380411.pdf?src-supplier=Element14; ComponentLink7URL: https://datasheet.ciiva.com/16760/70255313-16760341.pdf?src-supplier=Allied+Electronics; ComponentLink7Description: https://datasheet.ciiva.com/16760/70255313-16760341.pdf?src-supplier=Allied+Electronics; ComponentLink8URL: https://datasheet.ciiva.com/16765/70255313-16765244.pdf?src-supplier=Allied+Electronics; ComponentLink8Description: https://datasheet.ciiva.com/16765/70255313-16765244.pdf?src-supplier=Allied+Electronics; ComponentLink9URL: https://datasheet.ciiva.com/16199/aoa0000ce1-16199902.pdf?src-supplier=Future+Electronics; ComponentLink9Description: https://datasheet.ciiva.com/16199/aoa0000ce1-16199902.pdf?src-supplier=Future+Electronics
R111 = ERJ-3EKF1000V: 100 Ohm 1% 1/10W 0603 ±100ppm/°C Molded SMD Punched Carrier T/R; Manufacturer_Name: Panasonic; Power Rating: 100mW; Voltage Rating: 75V; Datasheet Link: http://industrial.panasonic.com/cdbs/www-data/pdf/RDA0000/AOA0000C86.pdf; Height: 0.55mm; Manufacturer_Part_Number: ERJ-3EKF1000V; Mouser Part Number: 667-ERJ-3EKF1000V; Mouser Price/Stock: https://www.mouser.co.uk/ProductDetail/Panasonic/ERJ-3EKF1000V?qs=H7k1u0Mp9JS7i8KGO5m47A%3D%3D; Arrow Part Number: ERJ-3EKF1000V; Arrow Price/Stock: https://www.arrow.com/en/products/erj-3ekf1000v/panasonic?utm_currency=USD&region=nac; Supplier: Digikey; Supplier Part Number: P100HCT-ND; Manufacturer: Panasonic; Manufacturer Part Number: ERJ-3EKF1000V; RoHS: Yes; Category: Chip SMD Resistors; Stock: 1036225; Pricing: 1=0.1, 10=0.035, 100=0.0177, 1000=0.01014, 2500=0.00888 (USD); Mounting Technology: Surface Mount; Case/Package: 0603; Contact Plating: Tin; Case Code (Imperial): 0603; Case Code (Metric): 1608; Weight: 7.1E-05oz; Min Operating Temperature: -55°C; Max Operating Temperature: 155°C; Packaging: Tape and Reel; Package Quantity: 5000; Termination: SMD/SMT; Series: ERJ; Value: 100R; Tolerance: 1%; Resistor Type: Thick Film; Number of Terminations: 2; Temperature Coefficient: 100ppm/°C; Max Power Dissipation: 100mW; Voltage Rating (DC): 75V; Features: Automotive AEC-Q200; Resistance Tolerance: 1%; Construction: Rectangular; Length: 1.6mm; Width: 0.8mm; Depth: 0.8mm; Radiation Hardening: No; Reach SVHC Compliant: No; Lead Free: Lead Free; RoHS Compliant: Yes; Military Standard: Not; ComponentLink1URL: https://datasheet.ciiva.com/34303/1987450-34303565.pdf?src-supplier=Jameco; ComponentLink1Description: https://datasheet.ciiva.com/34303/1987450-34303565.pdf?src-supplier=Jameco; ComponentLink2URL: https://datasheet.ciiva.com/9186/aoa0000ce2-9186725.pdf?src-supplier=Avnet; ComponentLink2Description: https://datasheet.ciiva.com/9186/aoa0000ce2-9186725.pdf?src-supplier=Avnet; ComponentLink3URL: https://datasheet.ciiva.com/48530/aoa0000ce2-48530986.pdf?src-supplier=Avnet; ComponentLink3Description: https://datasheet.ciiva.com/48530/aoa0000ce2-48530986.pdf?src-supplier=Avnet; ComponentLink4URL: https://datasheet.ciiva.com/7830/aoa0000ce2-7830728.pdf?src-supplier=Element14; ComponentLink4Description: https://datasheet.ciiva.com/7830/aoa0000ce2-7830728.pdf?src-supplier=Element14; ComponentLink5URL: https://datasheet.ciiva.com/22667/1678782-22667887.pdf?src-supplier=Element14; ComponentLink5Description: https://datasheet.ciiva.com/22667/1678782-22667887.pdf?src-supplier=Element14; ComponentLink6URL: https://datasheet.ciiva.com/46372/1678782-46372726.pdf?src-supplier=Element14; ComponentLink6Description: https://datasheet.ciiva.com/46372/1678782-46372726.pdf?src-supplier=Element14; ComponentLink7URL: https://datasheet.ciiva.com/46372/1678782-46372727.pdf?src-supplier=Element14; ComponentLink7Description: https://datasheet.ciiva.com/46372/1678782-46372727.pdf?src-supplier=Element14; ComponentLink8URL: https://datasheet.ciiva.com/24159/aoa0000ce2-24159753.pdf?src-supplier=Mouser; ComponentLink8Description: https://datasheet.ciiva.com/24159/aoa0000ce2-24159753.pdf?src-supplier=Mouser; ComponentLink9URL: https://datasheet.ciiva.com/16765/70260748-16765766.pdf?src-supplier=Allied+Electronics; ComponentLink9Description: https://datasheet.ciiva.com/16765/70260748-16765766.pdf?src-supplier=Allied+Electronics; ComponentLink10URL: https://datasheet.ciiva.com/16762/70260748-16762666.pdf?src-supplier=Allied+Electronics; ComponentLink10Description: https://datasheet.ciiva.com/16762/70260748-16762666.pdf?src-supplier=Allied+Electronics; ComponentLink11URL: https://datasheet.ciiva.com/30088/aoa0000ce2-30088649.pdf?src-supplier=Onlinecomponents.com; ComponentLink11Description: https://datasheet.ciiva.com/30088/aoa0000ce2-30088649.pdf?src-supplier=Onlinecomponents.com
R112 = ERJ-3EKF1742V: 17.4K Ohm 1% 1/10W +/-100ppm/ßC Molded Res Thick Film 0603  SMD Punched Carrier T/R; Manufacturer_Name: Panasonic; Power Rating: 100mW; Value: 17.4kR; Voltage Rating: 75V; Temperature Coefficient: 100ppm/°C; Voltage Rating (DC): 50V; Datasheet Link: http://industrial.panasonic.com/cdbs/www-data/pdf/RDA0000/AOA0000C86.pdf; Height: 0.55mm; Manufacturer_Part_Number: ERJ-3EKF1742V; Mouser Part Number: 667-ERJ-3EKF1742V; Mouser Price/Stock: https://www.mouser.co.uk/ProductDetail/Panasonic/ERJ-3EKF1742V?qs=H7k1u0Mp9JSZxDVRdeZLvA%3D%3D; Arrow Part Number: ERJ-3EKF1742V; Arrow Price/Stock: https://www.arrow.com/en/products/erj-3ekf1742v/panasonic; Supplier: Digikey; Supplier Part Number: P17.4KHCT-ND; Manufacturer: Panasonic; Manufacturer Part Number: ERJ-3EKF1742V; RoHS: Yes; Category: Chip SMD Resistors; Stock: 99931; Pricing: 1=0.1, 10=0.035, 100=0.0177, 1000=0.01014, 2500=0.00847 (USD); Mounting Technology: Surface Mount; Case/Package: 0603; Case Code (Metric): 1608; Case Code (Imperial): 0603; Contact Plating: Tin; Min Operating Temperature: -55°C; Max Operating Temperature: 155°C; Tolerance: 1%; Packaging: Tape and Reel; Package Quantity: 5000; Resistor Type: Thick Film; Number of Terminations: 2; Termination: SMD/SMT; Max Power Dissipation: 100mW; Features: Automotive AEC-Q200; Series: ERJ; Resistance Tolerance: 1%; Construction: Rectangular; Length: 1.6mm; Width: 0.8mm; Depth: 0.8mm; Reach SVHC Compliant: No; Military Standard: Not; Lead Free: Lead Free; RoHS Compliant: Yes; ComponentLink1URL: https://datasheet.ciiva.com/9192/aoa0000ce2-9192537.pdf?src-supplier=Avnet; ComponentLink1Description: https://datasheet.ciiva.com/9192/aoa0000ce2-9192537.pdf?src-supplier=Avnet; ComponentLink2URL: https://datasheet.ciiva.com/28531/1678782-28531550.pdf?src-supplier=Element14; ComponentLink2Description: https://datasheet.ciiva.com/28531/1678782-28531550.pdf?src-supplier=Element14; ComponentLink3URL: https://datasheet.ciiva.com/28672/1678782-28672319.pdf?src-supplier=Element14; ComponentLink3Description: https://datasheet.ciiva.com/28672/1678782-28672319.pdf?src-supplier=Element14; ComponentLink4URL: https://datasheet.ciiva.com/46377/426256-46377406.pdf?src-supplier=Element14; ComponentLink4Description: https://datasheet.ciiva.com/46377/426256-46377406.pdf?src-supplier=Element14; ComponentLink5URL: https://datasheet.ciiva.com/24026/aoa0000ce2-24026662.pdf?src-supplier=Mouser; ComponentLink5Description: https://datasheet.ciiva.com/24026/aoa0000ce2-24026662.pdf?src-supplier=Mouser; ComponentLink6URL: https://datasheet.ciiva.com/30059/aoa0000ce2-30059821.pdf?src-supplier=Onlinecomponents.com; ComponentLink6Description: https://datasheet.ciiva.com/30059/aoa0000ce2-30059821.pdf?src-supplier=Onlinecomponents.com
R113 = ERJ-3EKF1373V: 137K Ohm 1% 1/10W Res Thick Film 0603 ±100ppm/°C SMD Punched Carrier T/R; Manufacturer_Name: Panasonic; Value: 137kR; Power Rating: 100mW; Voltage Rating: 75V; Voltage Rating (DC): 50V; Datasheet Link: http://industrial.panasonic.com/cdbs/www-data/pdf/RDA0000/AOA0000C86.pdf; Height: 0.55mm; Manufacturer_Part_Number: ERJ-3EKF1373V; Mouser Part Number: 667-ERJ-3EKF1373V; Mouser Price/Stock: https://www.mouser.com/Search/Refine.aspx?Keyword=667-ERJ-3EKF1373V; Arrow Part Number: ERJ-3EKF1373V; Arrow Price/Stock: https://www.arrow.com/en/products/erj-3ekf1373v/panasonic; Supplier: Digikey; Supplier Part Number: P137KHCT-ND; Manufacturer: Panasonic; Manufacturer Part Number: ERJ-3EKF1373V; RoHS: Yes; Category: Chip SMD Resistors; Stock: 786997; Pricing: 1=0.1, 10=0.035, 100=0.0177, 1000=0.01014, 2500=0.00888 (USD); Mounting Technology: Surface Mount; Case/Package: 0603; Case Code (Imperial): 0603; Case Code (Metric): 1608; Contact Plating: Tin; Min Operating Temperature: -55°C; Max Operating Temperature: 155°C; Tolerance: 1%; Packaging: Tape and Reel; Package Quantity: 1; Resistor Type: Thick Film; Number of Terminations: 2; Temperature Coefficient: 100ppm/°C; Termination: SMD/SMT; Max Power Dissipation: 100mW; Features: Automotive AEC-Q200; Series: ERJ; Resistance Tolerance: 1%; Length: 0.063inch; Width: 0.8mm; Ratings: AEC-Q200; Reach SVHC Compliant: No; RoHS Compliant: Yes; Lead Free: 5697LeadFree; ComponentLink1URL: https://datasheet.ciiva.com/3883/3984280s8821682n1386-3883650.pdf?src-supplier=Arrow+Electronics; ComponentLink1Description: https://datasheet.ciiva.com/3883/3984280s8821682n1386-3883650.pdf?src-supplier=Arrow+Electronics; ComponentLink2URL: https://datasheet.ciiva.com/9185/aoa0000ce2-9185790.pdf?src-supplier=Avnet; ComponentLink2Description: https://datasheet.ciiva.com/9185/aoa0000ce2-9185790.pdf?src-supplier=Avnet; ComponentLink3URL: https://datasheet.ciiva.com/16788/70260748-16788101.pdf?src-supplier=Allied+Electronics; ComponentLink3Description: https://datasheet.ciiva.com/16788/70260748-16788101.pdf?src-supplier=Allied+Electronics; ComponentLink4URL: https://datasheet.ciiva.com/16762/70260748-16762069.pdf?src-supplier=Allied+Electronics; ComponentLink4Description: https://datasheet.ciiva.com/16762/70260748-16762069.pdf?src-supplier=Allied+Electronics; ComponentLink5URL: https://datasheet.ciiva.com/28594/1678782-28594598.pdf?src-supplier=Element14; ComponentLink5Description: https://datasheet.ciiva.com/28594/1678782-28594598.pdf?src-supplier=Element14; ComponentLink6URL: https://datasheet.ciiva.com/28692/1678782-28692248.pdf?src-supplier=Element14; ComponentLink6Description: https://datasheet.ciiva.com/28692/1678782-28692248.pdf?src-supplier=Element14; ComponentLink7URL: https://datasheet.ciiva.com/46389/426256-46389183.pdf?src-supplier=Element14; ComponentLink7Description: https://datasheet.ciiva.com/46389/426256-46389183.pdf?src-supplier=Element14
R114 = ERJ-3GEYJ104V: 100K Ohm 5%  Res Thick Film 0603 1/10W +/-200ppm/ßC Molded SMD Punched Carrier T/R; Manufacturer_Name: Panasonic; Value: 100kR; Power Rating: 100mW; Voltage Rating: 75V; Temperature Coefficient: 200ppm/°C; Voltage Rating (DC): 50V; Datasheet Link: http://docs-europe.electrocomponents.com/webdocs/13ba/0900766b813ba21b.pdf; Height: 0.55mm; Manufacturer_Part_Number: ERJ-3GEYJ104V; Mouser Part Number: 667-ERJ-3GEYJ104V; Mouser Price/Stock: https://www.mouser.co.uk/ProductDetail/Panasonic/ERJ-3GEYJ104V?qs=66DK8nO8gJC7IhSuep78kw%3D%3D; Arrow Part Number: ERJ-3GEYJ104V; Arrow Price/Stock: https://www.arrow.com/en/products/erj-3geyj104v/panasonic?region=nac; Supplier: Digikey; Supplier Part Number: P100KGCT-ND; Manufacturer: Panasonic; Manufacturer Part Number: ERJ-3GEYJ104V; RoHS: Yes; Category: Chip SMD Resistors; Stock: 248896; Pricing: 1=0.1, 10=0.033, 50=0.02, 100=0.0165, 500=0.01096, 1000=0.00939 (USD); Mounting Technology: Surface Mount; Case/Package: 0603; Case Code (Imperial): 0603; Case Code (Metric): 1608; Weight: 7.1E-05oz; Contact Plating: Tin; Min Operating Temperature: -55°C; Max Operating Temperature: 155°C; Tolerance: 5%; Packaging: Tape and Reel; Package Quantity: 1; Resistor Type: Thick Film; Termination: SMD/SMT; Number of Terminations: 2; Max Power Dissipation: 100mW; Features: Automotive AEC-Q200; Series: ERJ; Construction: Rectangular; Resistance Tolerance: 5%; Technology: THICK FILM; Length: 1.6mm; Width: 0.8mm; Depth: 0.8mm; Reach SVHC Compliant: No; Military Standard: Not; RoHS Compliant: Yes; ComponentLink1URL: https://datasheet.ciiva.com/11809/0900766b80f806dd-11809567.pdf?src-supplier=Rs; ComponentLink1Description: https://datasheet.ciiva.com/11809/0900766b80f806dd-11809567.pdf?src-supplier=Rs; ComponentLink2URL: https://datasheet.ciiva.com/22758/1678796-22758220.pdf?src-supplier=Farnell; ComponentLink2Description: https://datasheet.ciiva.com/22758/1678796-22758220.pdf?src-supplier=Farnell; ComponentLink3URL: https://datasheet.ciiva.com/43460/1678796-43460761.pdf?src-supplier=Farnell; ComponentLink3Description: https://datasheet.ciiva.com/43460/1678796-43460761.pdf?src-supplier=Farnell; ComponentLink4URL: https://datasheet.ciiva.com/24159/aoa0000ce1-37422-24159717.pdf?src-supplier=Mouser; ComponentLink4Description: https://datasheet.ciiva.com/24159/aoa0000ce1-37422-24159717.pdf?src-supplier=Mouser; ComponentLink5URL: https://datasheet.ciiva.com/46380/1678796-46380412.pdf?src-supplier=Element14; ComponentLink5Description: https://datasheet.ciiva.com/46380/1678796-46380412.pdf?src-supplier=Element14; ComponentLink6URL: https://datasheet.ciiva.com/46389/1678796-46389629.pdf?src-supplier=Element14; ComponentLink6Description: https://datasheet.ciiva.com/46389/1678796-46389629.pdf?src-supplier=Element14; ComponentLink7URL: https://datasheet.ciiva.com/27055/1988495-27055706.pdf?src-supplier=Jameco; ComponentLink7Description: https://datasheet.ciiva.com/27055/1988495-27055706.pdf?src-supplier=Jameco; ComponentLink8URL: https://datasheet.ciiva.com/16762/70255313-16762591.pdf?src-supplier=Allied+Electronics; ComponentLink8Description: https://datasheet.ciiva.com/16762/70255313-16762591.pdf?src-supplier=Allied+Electronics; ComponentLink9URL: https://datasheet.ciiva.com/16508/aoa0000ce1-16508383.pdf?src-supplier=Future+Electronics; ComponentLink9Description: https://datasheet.ciiva.com/16508/aoa0000ce1-16508383.pdf?src-supplier=Future+Electronics
R115 = ERJ-3GEYJ303V: 30K Ohm 5% 0.1W(1/10W) +/-200ppm/ßC Res Thick Film 0603  SMD Automotive T/R; Manufacturer_Name: Panasonic; Voltage Rating: 75V; Value: 30kR; Power Rating: 100mW; Temperature Coefficient: 200ppm/°C; Datasheet Link: http://docs-europe.electrocomponents.com/webdocs/13ba/0900766b813ba21b.pdf; Height: 0.55mm; Manufacturer_Part_Number: ERJ-3GEYJ303V; Mouser Part Number: 667-ERJ-3GEYJ303V; Mouser Price/Stock: https://www.mouser.co.uk/ProductDetail/Panasonic/ERJ-3GEYJ303V?qs=4WZYzuGhm5oupAe5agOIlw%3D%3D; Supplier: Digikey; Supplier Part Number: P30KGCT-ND; Manufacturer: Panasonic; Manufacturer Part Number: ERJ-3GEYJ303V; RoHS: Yes; Category: Chip SMD Resistors; Stock: 293565; Pricing: 1=0.1, 10=0.033, 50=0.02, 100=0.0165, 500=0.01096, 1000=0.00939 (USD); Mounting Technology: Surface Mount; Case/Package: 0603; Case Code (Imperial): 0603; Case Code (Metric): 1608; Contact Plating: Tin; Min Operating Temperature: -55°C; Max Operating Temperature: 155°C; Packaging: Tape and Reel; Tolerance: 5%; Package Quantity: 1; Resistor Type: Thick Film; Number of Terminations: 2; Termination: SMD/SMT; Max Power Dissipation: 100mW; Features: Automotive AEC-Q200; Series: ERJ; Construction: Rectangular; Resistance Tolerance: 5%; Technology: THICK FILM; Voltage Rating (DC): 75V; Length: 1.6mm; Width: 0.8mm; Depth: 0.8mm; Reach SVHC Compliant: No; Military Standard: Not; RoHS Compliant: Yes; Lead Free: 5697LeadFree; ComponentLink1URL: https://datasheet.ciiva.com/11821/0900766b80f806dd-11821446.pdf?src-supplier=Rs; ComponentLink1Description: https://datasheet.ciiva.com/11821/0900766b80f806dd-11821446.pdf?src-supplier=Rs; ComponentLink2URL: https://datasheet.ciiva.com/5917/1500035-5917845.pdf?src-supplier=Farnell; ComponentLink2Description: https://datasheet.ciiva.com/5917/1500035-5917845.pdf?src-supplier=Farnell; ComponentLink3URL: https://datasheet.ciiva.com/43460/1500035-43460749.pdf?src-supplier=Farnell; ComponentLink3Description: https://datasheet.ciiva.com/43460/1500035-43460749.pdf?src-supplier=Farnell; ComponentLink4URL: https://datasheet.ciiva.com/46387/1500035-46387151.pdf?src-supplier=Element14; ComponentLink4Description: https://datasheet.ciiva.com/46387/1500035-46387151.pdf?src-supplier=Element14; ComponentLink5URL: https://datasheet.ciiva.com/30079/4aoa0000ce1-30079549.pdf?src-supplier=Onlinecomponents.com; ComponentLink5Description: https://datasheet.ciiva.com/30079/4aoa0000ce1-30079549.pdf?src-supplier=Onlinecomponents.com; ComponentLink6URL: https://datasheet.ciiva.com/28676/1678796-28676989.pdf?src-supplier=Element14; ComponentLink6Description: https://datasheet.ciiva.com/28676/1678796-28676989.pdf?src-supplier=Element14; ComponentLink7URL: https://datasheet.ciiva.com/16769/70255313-16769897.pdf?src-supplier=Allied+Electronics; ComponentLink7Description: https://datasheet.ciiva.com/16769/70255313-16769897.pdf?src-supplier=Allied+Electronics